# EAGLE design booz_imu_xz (EAGLE 4.16)
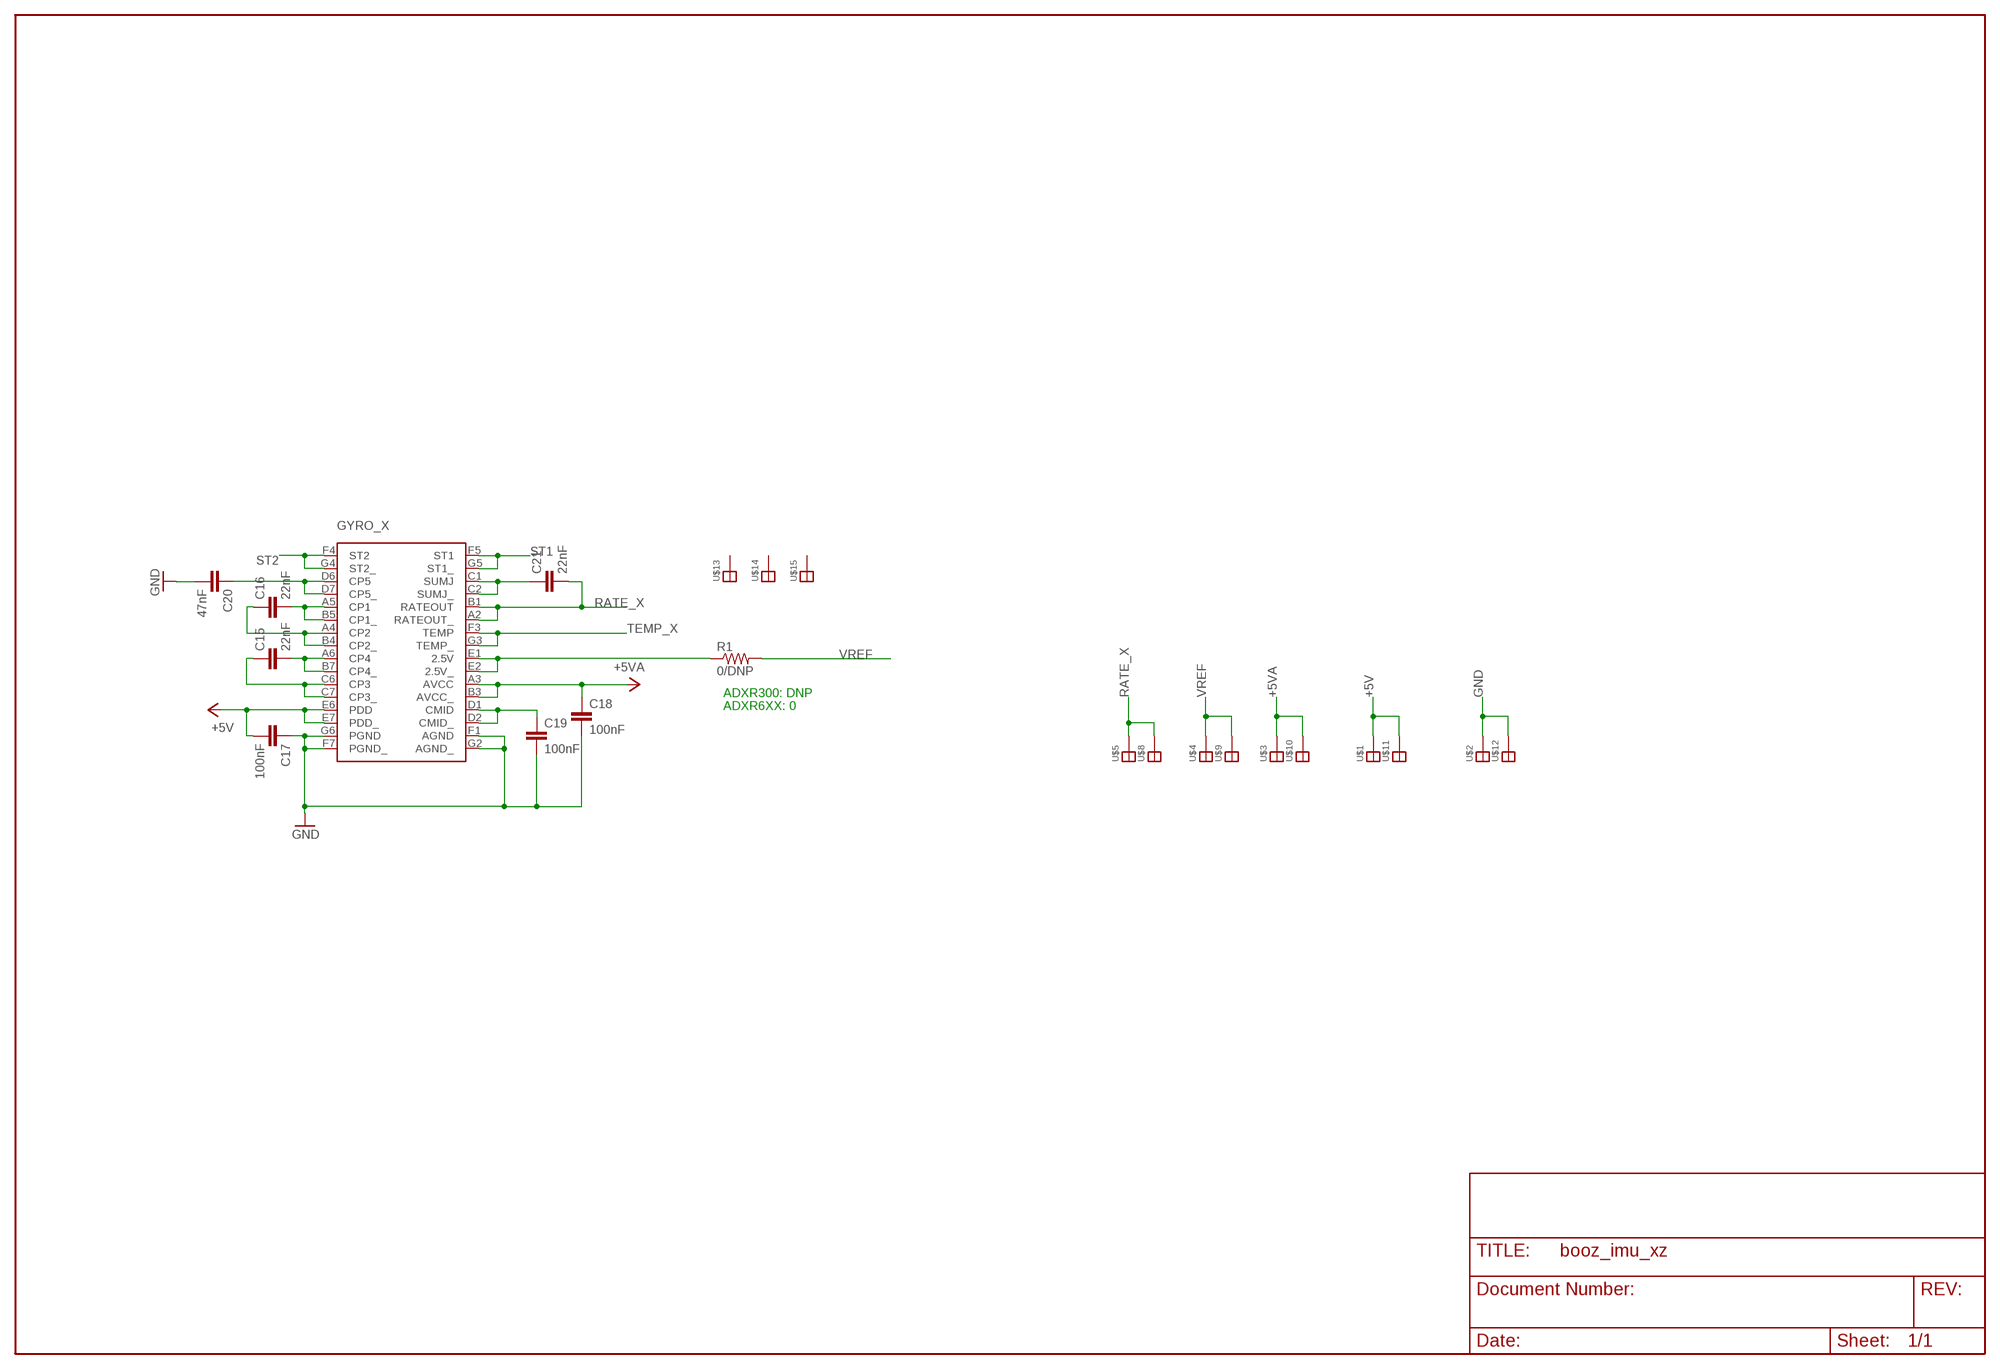
[diagram p0: schematic, sheet 1]

## Parts
C15  22nF  C-EUC0603K  [C0603K]
C16  22nF  C-EUC0603K  [C0603K]
C17  100nF  C-EUC0603K  [C0603K]
C18  100nF  C-EUC0603K  [C0603K]
C19  100nF  C-EUC0603K  [C0603K]
C20  47nF  C-EUC0603K  [C0603K]
C21  22nF  C-EUC0603K  [C0603K]
GYRO_X  ADXR  [BC-32]
R1  0/DNP  R-US_R0603  [R0603]
U$1  SOLDER_PAD  [SOLDER_PAD]
U$2  SOLDER_PAD  [SOLDER_PAD]
U$3  SOLDER_PAD  [SOLDER_PAD]
U$4  SOLDER_PAD  [SOLDER_PAD]
U$5  SOLDER_PAD  [SOLDER_PAD]
U$8  SOLDER_PAD  [SOLDER_PAD]
U$9  SOLDER_PAD  [SOLDER_PAD]
U$10  SOLDER_PAD  [SOLDER_PAD]
U$11  SOLDER_PAD  [SOLDER_PAD]
U$12  SOLDER_PAD  [SOLDER_PAD]
U$13  SOLDER_PAD  [SOLDER_PAD]
U$14  SOLDER_PAD  [SOLDER_PAD]
U$15  SOLDER_PAD  [SOLDER_PAD]

## Nets
+5V: C17.2 GYRO_X.E6(PDD) GYRO_X.E7(PDD_) U$1.P$1 U$11.P$1
+5VA: C18.1 GYRO_X.A3(AVCC) GYRO_X.B3(AVCC_) U$3.P$1 U$10.P$1
GND: C17.1 C18.2 C19.2 C20.2 GYRO_X.F1(AGND) GYRO_X.F7(PGND_) GYRO_X.G2(AGND_) GYRO_X.G6(PGND) U$2.P$1 U$12.P$1
N$6: C21.1 GYRO_X.C1(SUMJ) GYRO_X.C2(SUMJ_)
N$7: C15.1 GYRO_X.C6(CP3) GYRO_X.C7(CP3_)
N$11: C20.1 GYRO_X.D6(CP5) GYRO_X.D7(CP5_)
N$12: C16.2 GYRO_X.A5(CP1) GYRO_X.B5(CP1_)
N$13: C16.1 GYRO_X.A4(CP2) GYRO_X.B4(CP2_)
N$14: C15.2 GYRO_X.A6(CP4) GYRO_X.B7(CP4_)
N$17: GYRO_X.E1(2.5V) GYRO_X.E2(2.5V_) R1.1
N$19: C19.1 GYRO_X.D1(CMID) GYRO_X.D2(CMID_)
RATE_X: C21.2 GYRO_X.A2(RATEOUT_) GYRO_X.B1(RATEOUT) U$5.P$1 U$8.P$1
ST1: GYRO_X.F5(ST1) GYRO_X.G5(ST1_)
ST2: GYRO_X.F4(ST2) GYRO_X.G4(ST2_)
TEMP_X: GYRO_X.F3(TEMP) GYRO_X.G3(TEMP_)
VREF: R1.2 U$4.P$1 U$9.P$1
Unconnected: U$13.P$1 U$14.P$1 U$15.P$1

## Notes on the sheet
- ADXR300: DNP
- ADXR6XX: 0

## Library data of the parts
C15-C21 = rcl:C-EU: CAPACITOR, European symbol
GYRO_X = paparazzi:ADXR
R1 = rcl:R-US_: RESISTOR, American symbol
U$1-U$5 U$8-U$15 = paparazzi:SOLDER_PAD

## Board
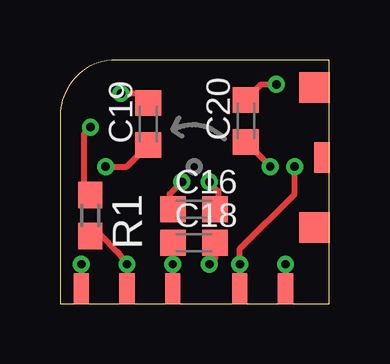
[diagram p1: board, top side]
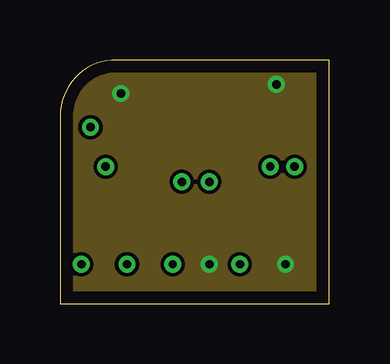
[diagram p2: board, inner layer Route2]
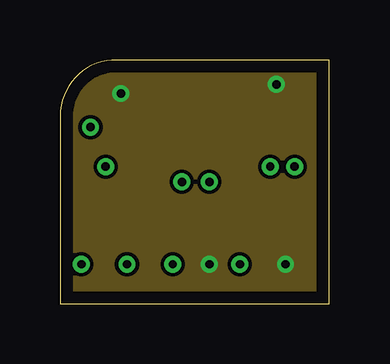
[diagram p3: board, inner layer Route15]
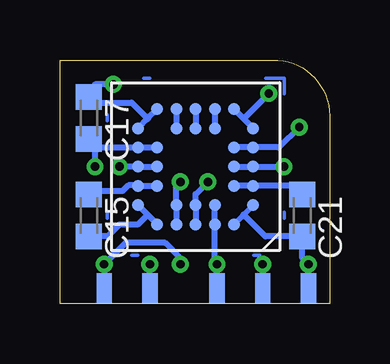
[diagram p4: board, bottom side, seen from below]

Size 11.23 x 10.16 mm. Coordinates in mm from the lower left corner, seen from the top.
Outline: 11.23,10.15 11.23,0 0.01,0 0.01,7.62 arc-90 2.16,10.16 11.21,10.16
Copper layers (1*2+15*16): Top 0.035mm / dielectric 0.2mm / Route2 0.035mm / dielectric 1.5mm / Route15 0.035mm / dielectric 0.2mm / Bottom 0.035mm
Design rules "eurocircuits_verified_4l": minimum track width 0.15mm, minimum drill 0.35mm, track to track 0.15mm, track to pad 0.15mm, pad to pad 0.15mm, via to via 0.15mm, smd to smd 0.15mm, copper to edge 20mil, drill to drill 8mil, minimum pad ring 0.177mm, minimum via ring 0.177mm, stop-mask expansion 4mil, vias tented up to drill 14mil, thermal gap 10mil

### Footprints (pad centres in the part's own frame; a part is rotated, then mirrored left to right if it is on the bottom)
C0603K = smd 1.05 x 1.08: 1 -0.875,0; 2 0.875,0
BC-32 = smd 0.5 x 0.5: A2 -1.6,2.4; A3 -0.8,2.4; A4 0,2.4; A5 0.8,2.4; A6 1.6,2.4; B1 -2.4,1.6; B3 -0.8,1.6; B4 0,1.6; B5 0.8,1.6; B7 2.4,1.6; C1 -2.4,0.8; C2 -1.6,0.8; C6 1.6,0.8; C7 2.4,0.8; D1 -2.4,0; D2 -1.6,0; D6 1.6,0; D7 2.4,0; E1 -2.4,-0.8; E2 -1.6,-0.8; E6 1.6,-0.8; E7 2.4,-0.8; F1 -2.4,-1.6; F3 -0.8,-1.6; F4 0,-1.6; F5 0.8,-1.6; F7 2.4,-1.6; G2 -1.6,-2.4; G3 -0.8,-2.4; G4 0,-2.4; G5 0.8,-2.4; G6 1.6,-2.4
R0603 = smd 1.1 x 1: 1 -0.85,0; 2 0.85,0
SOLDER_PAD = smd 0.635 x 1.27: P$1 0,0

### Placement (x,y rotation side)
C15  10.03,3.68 270 bottom
C16  5.59,3.94 0 top
C17  10.03,7.75 270 bottom
C18  5.59,2.54 0 top
C19  3.68,7.49 90 top
C20  7.75,7.62 90 top
C21  1.14,3.68 270 bottom
GYRO_X  5.59,5.72 180 bottom
R1  1.27,3.68 270 top
U$1  7.49,0.64 180 top
U$2  9.4,0.64 180 top
U$3  4.7,0.64 180 top
U$4  2.79,0.64 180 top
U$5  0.89,0.64 180 top
U$6  SOLDER_PAD  [SOLDER_PAD]  10.29,9.02 0 top
U$8  0.89,0.64 0 bottom
U$9  2.79,0.64 0 bottom
U$10  4.7,0.64 0 bottom
U$11  7.49,0.64 0 bottom
U$12  9.4,0.64 0 bottom
U$13  10.92,9.02 0 top
U$14  10.92,6.1 0 top
U$15  10.92,3.17 0 top
U$16  SOLDER_PAD  [SOLDER_PAD]  10.29,3.17 0 top

### Tracks (layer width: path | path; a pad name or v marks a point on that pad's centre or on a via)
+5V  (via drill 0.35)
  Top 0.254: U$11.P$1 v7.49,1.65 7.49,2.29 9.78,4.57 v9.78,5.72
  Bottom 0.254: U$11.P$1 v7.49,1.65 | C17.2 10.03,6.86 9.69,6.51 9.65,6.51 | 9.65,6.51 GYRO_X.E7 7.99,6.49 | 9.65,6.51 9.65,6.48 9.78,6.35 v9.78,5.72 | 7.99,6.49 8,6.48 | GYRO_X.E6 7.96,6.51 7.99,6.49
+5VA  (via drill 0.35)
  Top 0.254: U$10.P$1 v4.7,1.65 C18.1
  Bottom 0.203: 4.81,3.32 4.82,3.3 | GYRO_X.A3 4.81,3.32 | 4.81,3.32 4.79,3.34
  Bottom 0.254: U$10.P$1 v4.7,1.65 4.79,1.74 GYRO_X.A3 | 4.79,3.34 GYRO_X.B3
GND  (via drill 0.35)
  Top 0.254: v9.4,1.65 U$12.P$1 | C19.2 3.68,8.38 3.3,8.76 v2.54,8.76 | C20.2 8.39,9.14 v9.02,9.14 | C18.2 6.48,2.54 6.48,1.91 v6.22,1.65
  Bottom 0.203: GYRO_X.F7 8,7.33 8,7.37 7.94,7.37 | GYRO_X.F1 3.17,7.32 | GYRO_X.F1 | GYRO_X.F1
  Bottom 0.254: U$12.P$1 v9.4,1.65 8.51,2.54 6.86,2.54 6.22,1.91 v6.22,1.65 | 3.59,7.72 GYRO_X.G2 | 3.59,7.72 GYRO_X.F1 | v2.54,8.76 3.59,7.72 | 7.62,7.75 8.25,8.38 9.92,8.38 C17.1 10.03,8.89 9.78,9.14 v9.02,9.14 | GYRO_X.G6 7.55,7.75 7.62,7.75 | 7.94,7.37 7.62,7.68 7.62,7.75
  pour Route2: 11.17,10.03 0.13,10.03 0.13,0.13 11.17,0.13
  pour Route15: 0.13,0.13 11.17,0.13 11.17,10.03 0.13,10.03
N$1
  Bottom 0.152: 2.67,9.4 1.9,9.4 1.9,8.76
N$2
  Bottom 0.152: 7.49,9.4 7.75,9.4
N$3
  Bottom 0.152: 9.27,7.87 9.27,7.62
N$4
  Bottom 0.152: 9.27,3.81 9.27,3.56
N$5
  Bottom 0.152: 1.9,3.56 1.9,3.81
N$6
  Bottom 0.203: GYRO_X.C1 3.17,4.92 3.17,4.95
  Bottom 0.254: GYRO_X.C2 GYRO_X.C1 2.12,4.92 1.48,4.92 1.14,4.57 C21.1
N$7
  Bottom 0.203: 7.99,4.94 8,4.95 | GYRO_X.C7 7.99,4.94 | 7.99,4.94 7.96,4.92 | C15.1 9.9,4.57
  Bottom 0.254: 7.96,4.92 GYRO_X.C6 | 7.99,4.94 8.39,4.94 8.63,4.7 9.9,4.7 10.03,4.57 C15.1
N$8
  Bottom 0.152: 2.92,2.03 3.17,2.03
N$9
  Bottom 0.152: 8,2.03 8.25,2.03
N$11  (via drill 0.35)
  Top 0.254: C20.1 8.76,5.73 v8.76,5.72
  Bottom 0.254: GYRO_X.D6 GYRO_X.D7 v8.76,5.72
N$12  (via drill 0.35)
  Top 0.254: C16.2 6.6,3.94 6.6,4.7 v6.22,5.08
  Bottom 0.203: 6.36,3.32 6.35,3.3 | 6.36,3.32 GYRO_X.A5 | 6.39,3.34 6.36,3.32
  Bottom 0.254: 6.39,3.34 GYRO_X.B5 6.39,4.92 v6.22,5.08
N$13  (via drill 0.35)
  Top 0.254: C16.1 4.57,3.94 4.57,4.57 v5.08,5.08
  Bottom 0.203: GYRO_X.A4 5.59,3.3
  Bottom 0.254: GYRO_X.A4 GYRO_X.B4 5.59,4.57 v5.08,5.08
N$14
  Bottom 0.203: GYRO_X.B7 8,4.1 8,4.06 7.94,4.06
  Bottom 0.254: 7.94,4.06 7.59,3.71 | 7.59,3.71 GYRO_X.A6 | C15.2 9.26,2.81 8.76,3.3 8,3.3 7.59,3.71
N$17  (via drill 0.35)
  Top 0.254: R1.1 1.1,4.7 1.01,4.7 1.01,7.11 v1.27,7.37
  Bottom 0.203: GYRO_X.E2 4.02,6.51 4.06,6.48 | 2.12,6.51 2.16,6.51
  Bottom 0.254: 4.02,6.51 GYRO_X.E1 2.16,6.51 | v1.27,7.37 2.12,6.51
N$19  (via drill 0.35)
  Top 0.254: C19.1 2.78,5.72 v1.9,5.72
  Bottom 0.203: GYRO_X.D1 3.17,5.72 | v1.9,5.72 2.03,5.72
  Bottom 0.254: GYRO_X.D2 GYRO_X.D1 v1.9,5.72
RATE_X  (via drill 0.35)
  Top 0.254: v0.89,1.65 U$8.P$1
  Bottom 0.203: GYRO_X.A2 3.97,3.3 3.94,3.3 3.94,3.37 3.59,3.71 GYRO_X.B1
  Bottom 0.254: U$8.P$1 v0.89,1.65 1.14,1.91 C21.2 | C21.2 2.68,2.81 3.59,3.71 | C21.2 1.14,2.92
ST1
  Bottom 0.203: 6.36,8.11 6.35,8.13 | GYRO_X.G5 6.36,8.11 | 6.36,8.11 6.39,8.09
  Bottom 0.254: 6.39,8.09 GYRO_X.F5
ST2
  Bottom 0.203: GYRO_X.G4 5.59,8.13
  Bottom 0.254: GYRO_X.G4 GYRO_X.F4
TEMP_X
  Bottom 0.203: 4.81,8.11 4.82,8.13 | GYRO_X.G3 4.81,8.11 | 4.81,8.11 4.79,8.09
  Bottom 0.254: 4.79,8.09 GYRO_X.F3
VREF  (via drill 0.35)
  Top 0.203: R1.2 1.27,2.79
  Top 0.254: U$9.P$1 v2.79,1.65 2.41,2.16 1.65,2.92 1.56,2.83 R1.2
  Bottom 0.254: v2.79,1.65 U$9.P$1

### Text on the board
tDocu: p